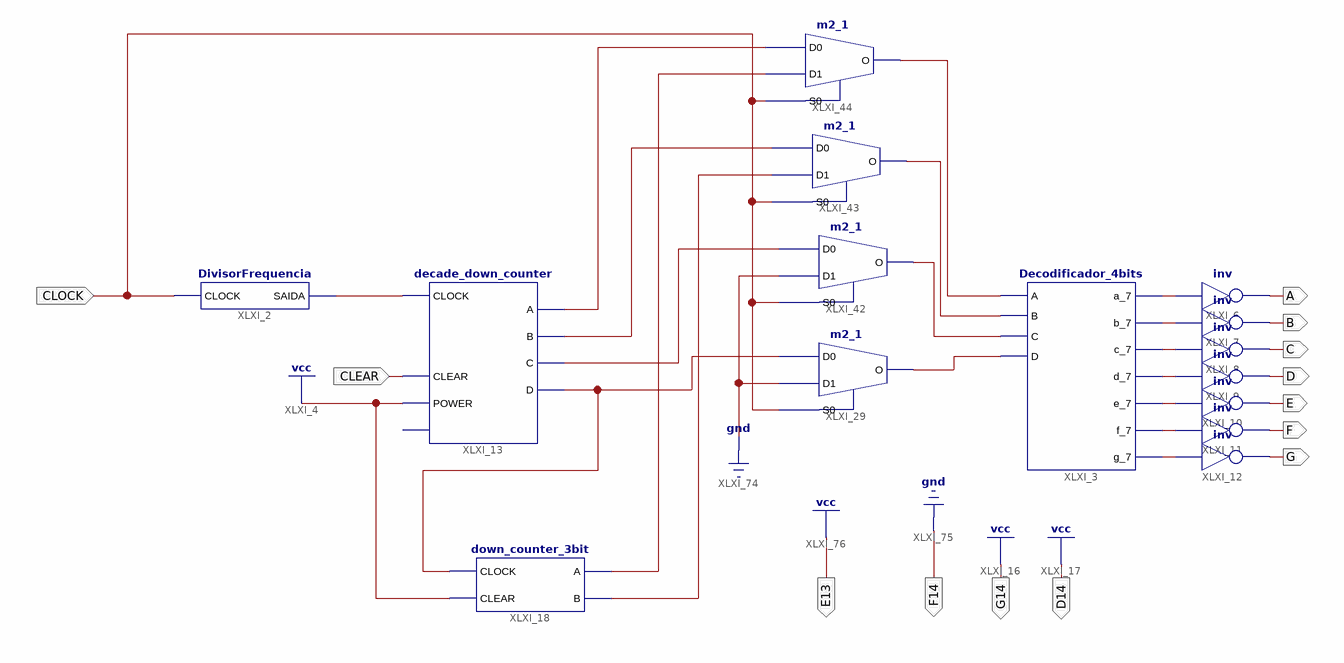
[diagram p0: schematic sheet 1]
// Xilinx ISE schematic teste_contador.sch (spartan3) as structural Verilog: 15 symbols, 13 ports
module teste_contador (
  input  CLEAR,
  input  CLOCK,
  output A,
  output B,
  output C,
  output D,
  output E,
  output F,
  output G,
  output G14,
  output D14,
  output E13,
  output F14
);

  wire XLXN_1, XLXN_30, XLXN_31, XLXN_32, XLXN_33, XLXN_34, XLXN_35, XLXN_36, XLXN_56, XLXN_112, XLXN_113,
       XLXN_114, XLXN_115, XLXN_122, XLXN_123, XLXN_124, XLXN_125, XLXN_126;

  DivisorFrequencia XLXI_2 (.CLOCK(CLOCK), .SAIDA(XLXN_1));
  decade_down_counter XLXI_13 (
    .CLOCK(XLXN_1), .POWER(1'b1), .CLEAR(CLEAR), .C(XLXN_115), .D(XLXN_126), .B(XLXN_113), .A(XLXN_112));  // open: CE
  Decodificador_4bits XLXI_3 (
    .a_7(XLXN_30), .b_7(XLXN_31), .c_7(XLXN_32), .d_7(XLXN_33), .e_7(XLXN_34), .f_7(XLXN_35), .g_7(XLXN_36),
    .A(XLXN_122), .B(XLXN_123), .C(XLXN_124), .D(XLXN_125));
  not XLXI_6 (A, XLXN_30);
  not XLXI_7 (B, XLXN_31);
  not XLXI_8 (C, XLXN_32);
  not XLXI_9 (D, XLXN_33);
  not XLXI_10 (E, XLXN_34);
  not XLXI_11 (F, XLXN_35);
  not XLXI_12 (G, XLXN_36);
  m2_1 XLXI_29 (.D0(XLXN_126), .D1(1'b0), .S0(CLOCK), .O(XLXN_125));
  m2_1 XLXI_42 (.D0(XLXN_115), .D1(1'b0), .S0(CLOCK), .O(XLXN_124));
  m2_1 XLXI_43 (.D0(XLXN_113), .D1(XLXN_114), .S0(CLOCK), .O(XLXN_123));
  m2_1 XLXI_44 (.D0(XLXN_112), .D1(XLXN_56), .S0(CLOCK), .O(XLXN_122));
  down_counter_3bit XLXI_18 (.CLOCK(XLXN_126), .CLEAR(1'b1), .A(XLXN_56), .B(XLXN_114));

  assign D14 = 1'b1;
  assign E13 = 1'b1;
  assign F14 = 1'b0;
  assign G14 = 1'b1;
endmodule
